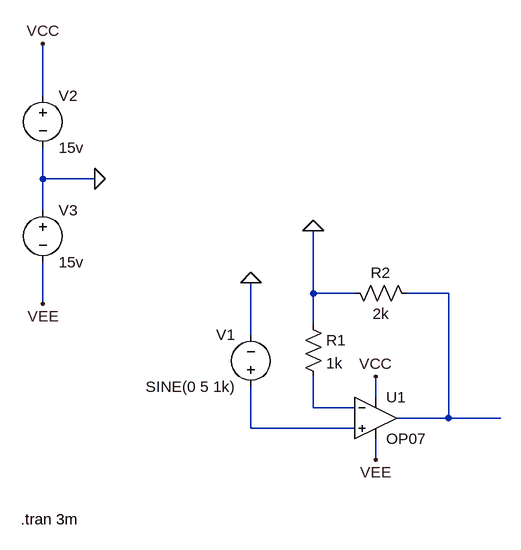
[diagram p0: schematic Non-Inverting.asc]
Non-Inverting.asc, the LTspice schematic file:
Version 4
SHEET 1 880 680
WIRE -240 -320 -240 -400
WIRE -240 -192 -240 -240
WIRE -160 -192 -240 -192
WIRE -240 -144 -240 -192
WIRE 176 -16 176 -112
WIRE 240 -16 176 -16
WIRE 384 -16 320 -16
WIRE -240 0 -240 -64
WIRE 176 32 176 -16
WIRE 80 48 80 -32
WIRE 272 144 272 112
WIRE 176 160 176 112
WIRE 240 160 176 160
WIRE 384 176 384 -16
WIRE 384 176 304 176
WIRE 464 176 384 176
WIRE 80 192 80 128
WIRE 240 192 80 192
WIRE 272 240 272 208
FLAG 176 -112 0
FLAG 80 -32 0
FLAG -160 -192 0
FLAG 272 112 VCC
FLAG -240 -400 VCC
FLAG 272 240 VEE
FLAG -240 0 VEE
SYMBOL OpAmps\\OP07 272 112 R0
SYMATTR InstName U1
SYMBOL res 160 16 R0
SYMATTR InstName R1
SYMATTR Value 1k
SYMBOL res 224 -32 M90
WINDOW 0 0 56 VBottom 2
WINDOW 3 32 56 VTop 2
SYMATTR InstName R2
SYMATTR Value 2k
SYMBOL voltage 80 144 R180
WINDOW 0 24 96 Left 2
WINDOW 3 24 16 Left 2
WINDOW 123 0 0 Left 0
WINDOW 39 0 0 Left 0
SYMATTR InstName V1
SYMATTR Value SINE(0 5 1k)
SYMBOL voltage -240 -336 R0
WINDOW 123 0 0 Left 0
WINDOW 39 0 0 Left 0
SYMATTR InstName V2
SYMATTR Value 15v
SYMBOL voltage -240 -160 R0
WINDOW 123 0 0 Left 0
WINDOW 39 0 0 Left 0
SYMATTR InstName V3
SYMATTR Value 15v
TEXT -274 332 Left 2 !.tran 3m

The netlist it stands for:
* Non-Inverting.asc
XU1 N003 N002 VCC VEE N001 LT1001  ; OP07, pins In+ In- V+ V- OUT
R1 0 N002 1k
R2 0 N001 2k
V1 N003 0 SINE(0 5 1k)
V2 VCC 0 15v
V3 0 VEE 15v
.tran 3m
.lib LTC.lib
.backanno
.end